# EAGLE design LPC2LCD (EAGLE 9.3.1)
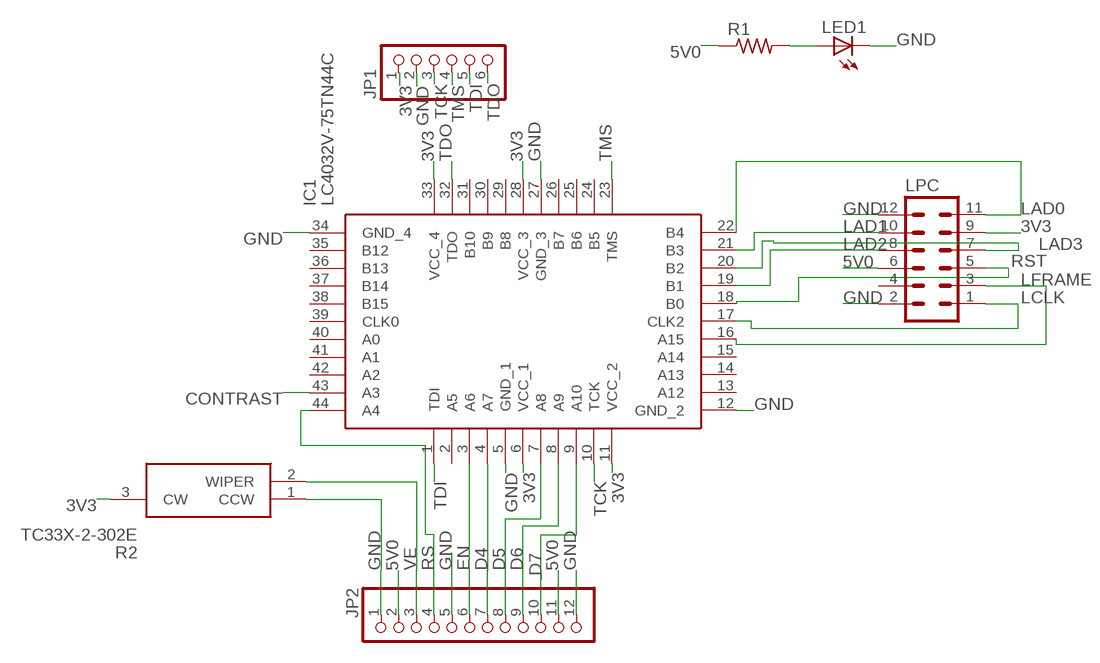
[diagram p0: schematic, sheet 1]

## Parts
IC1  LC4032V-75TN44C  [QFP80P1200X1200X120-44N]
JP1  PINHD-1X6B  [1X06-BIG]
JP2  PINHD-1X12  [1X12]
LED1  LEDCHIPLED_0805  [CHIPLED_0805]
LPC  MA06-2  [MA06-2]
R1  R-US_R0805  [R0805]
R2  TC33X-2-302E  [TC33X-2]

## Nets
3V3: IC1.6(VCC_1) IC1.11(VCC_2) IC1.28(VCC_3) IC1.33(VCC_4) JP1.1 LPC.9 R2.3(CW)
5V0: JP2.2 JP2.11 LPC.6 R1.1
CONTRAST: IC1.43(A3)
D4: IC1.4(A7) JP2.7
D5: IC1.7(A8) JP2.8
D6: IC1.8(A9) JP2.9
D7: IC1.9(A10) JP2.10
EN: IC1.3(A6) JP2.6
GND: IC1.5(GND_1) IC1.12(GND_2) IC1.27(GND_3) IC1.34(GND_4) JP1.2 JP2.1 JP2.5 JP2.12 LED1.C LPC.2 LPC.12 R2.1(CCW)
LAD0: IC1.22(B4) LPC.11
LAD1: IC1.21(B3) LPC.10
LAD2: IC1.19(B1) LPC.8
LAD3: IC1.20(B2) LPC.7
LCLK: IC1.17(CLK2) LPC.1
LFRAME: IC1.16(A15) LPC.3
N$1: LED1.A R1.2
RS: IC1.44(A4) JP2.4
RST: IC1.18(B0) LPC.5
TCK: IC1.10(TCK) JP1.3
TDI: IC1.1(TDI) JP1.5
TDO: IC1.32(TDO) JP1.6
TMS: IC1.23(TMS) JP1.4
VE: JP2.3 R2.2(WIPER)
Unconnected: IC1.2(A5) IC1.13(A12) IC1.14(A13) IC1.15(A14) IC1.24(B5) IC1.25(B6) IC1.26(B7) IC1.29(B8) IC1.30(B9) IC1.31(B10) IC1.35(B12) IC1.36(B13) IC1.37(B14) IC1.38(B15) IC1.39(CLK0) IC1.40(A0) IC1.41(A1) IC1.42(A2) LPC.4

## Library data of the parts
IC1 = SamacSys_Parts:LC4032V-75TN44C: LC4032V-75TN44C, CPLD ispMACH 4000V EEPROM 32 Cells, 30 I/O, 36 Labs, 7.5ns, ISP, 3 3.6 V 44-Pin TQFP Source: Datasheet <https://componentsearchengine.com/Datasheets/1/LC4032V-75TN44C.pdf>; DESCRIPTION: LC4032V-75TN44C, CPLD ispMACH 4000V EEPROM 32 Cells, 30 I/O, 36 Labs, 7.5ns, ISP, 3 3.6 V 44-Pin TQFP; HEIGHT: 1.2mm; MANUFACTURER_NAME: Lattice Semiconductor; MANUFACTURER_PART_NUMBER: LC4032V-75TN44C; MOUSER_PART_NUMBER: 842-LC4032V75TN44C; MOUSER_PRICE-STOCK: https://www.mouser.com/Search/Refine.aspx?Keyword=842-LC4032V75TN44C
JP1 = adafruit:PINHD-1X6: PIN HEADER
JP2 = adafruit:PINHD-1X12: PIN HEADER
LED1 = adapter_ms9282:LED: LED OSRAM: - CHIPLED LG R971, LG N971, LY N971, LG Q971, LY Q971, LO R971, LY R971 LH N974, LH R974 LS Q976, LO Q976, LY Q976 LO Q996 - Hyper CHIPLED LW Q18S LB Q993, LB Q99A, LB R99A - SideLED LS A670, LO A670, LY A670, LG A670, LP A670 LB A673, LV A673, LT A673, LW A673 LH A674 LY A675 LS A676, LA A676, LO A676, LY A676, LW A676 LS A679, LY A679, LG A679 - Hyper Micro SIDELED® LS Y876, LA Y876, LO Y876, LY Y876 LT Y87S - SmartLED LW L88C, LW L88S LB L89C, LB L89S, LG L890 LS L89K, LO L89K, LY L89K LS L896, LA L896, LO L896, LY L896 - TOPLED LS T670, LO T670, LY T670, LG T670, LP T670 LSG T670, LSP T670, LSY T670, LOP T670, LYG T670 LG T671, LOG T671, LSG T671 LB T673, LV T673, LT T673, LW T673 LH T674 LS T676, LA T676, LO T676, LY T676, LB T676, LH T676, LSB T676, LW T676 LB T67C, LV T67C, LT T67C, LS T67K, LO T67K, LY T67K, LW E67C LS E67B, LA E67B, LO E67B, LY E67B, LB E67C, LV E67C, LT E67C LW T67C LS T679, LY T679, LG T679 LS T770, LO T770, LY T770, LG T770, LP T770 LB T773, LV T773, LT T773, LW T773 LH T774 LS E675, LA E675, LY E675, LS T675 LS T776, LA T776, LO T776, LY T776, LB T776 LHGB T686 LT T68C, LB T68C - Hyper Mini TOPLED® LB M676 - Mini TOPLED Santana® LG M470 LS M47K, LO M47K, LY M47K Source: http://www.osram.convergy.de/
LPC = con-lstb:MA06-2: PIN HEADER; OC_FARNELL: unknown; OC_NEWARK: unknown
R1 = adapter_ms9282:R-US_: RESISTOR, American symbol
R2 = OXC_Library:TC33X-2-302E: Trimmer Resistors - SMD 3MM 3KOHMS 25% 0.1WATT OPEN FRM Source: Datasheet <https://componentsearchengine.com/Datasheets/1/TC33X-2-302E.pdf>; DESCRIPTION: Trimmer Resistors - SMD 3MM 3KOHMS 25% 0.1WATT OPEN FRM; HEIGHT: mm; MANUFACTURER_NAME: Bourns; MANUFACTURER_PART_NUMBER: TC33X-2-302E; MOUSER_PART_NUMBER: 652-TC33X-2-302E; MOUSER_PRICE-STOCK: https://www.mouser.com/Search/Refine.aspx?Keyword=652-TC33X-2-302E

## Board
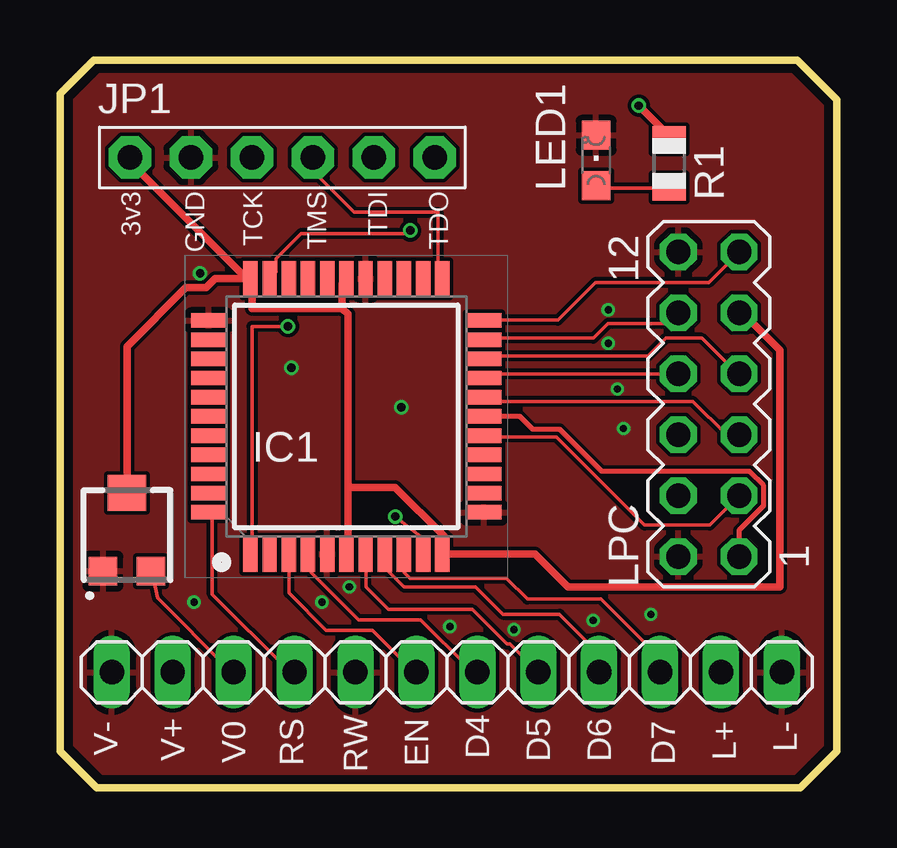
[diagram p1: board, top side]
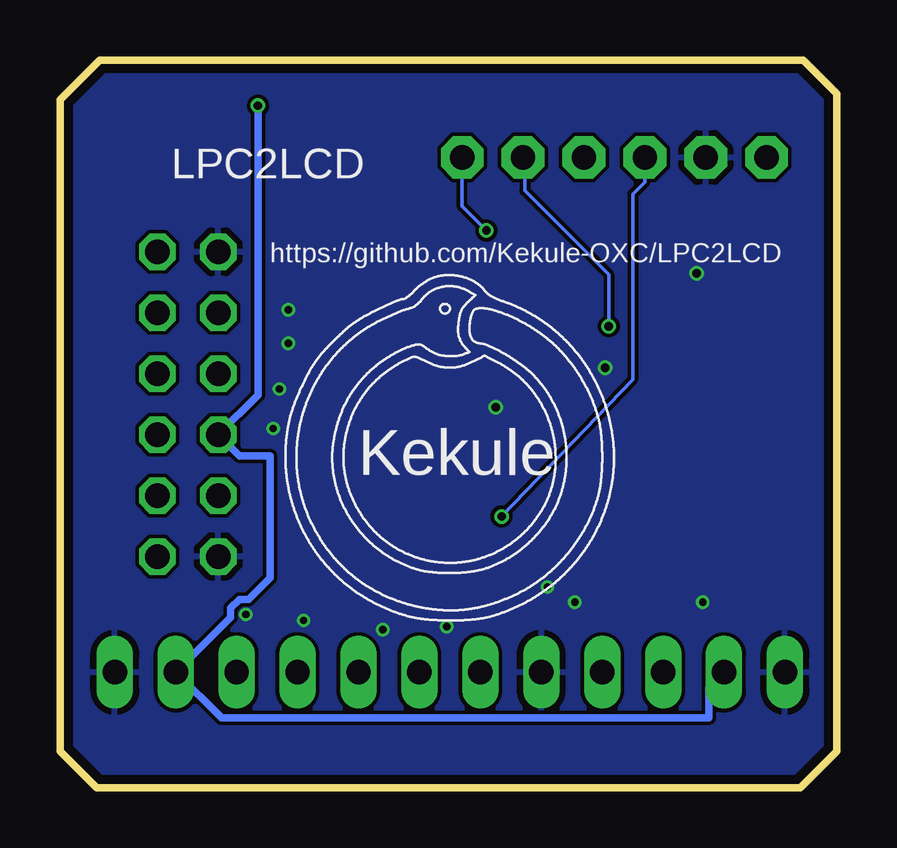
[diagram p2: board, bottom side, seen from below]

Size 32.38 x 30.35 mm. Coordinates in mm from the lower left corner, seen from the top.
Outline: 0,28.96 0,1.52 1.52,0 30.86,0 32.38,1.52 32.38,28.7 30.73,30.35 1.4,30.35 0,28.96
Copper layers (1*16): Top 0.035559375mm / dielectric 1.6mm / Bottom 0.035559375mm
Design rules "oshpark-2layer": minimum track width 6mil, minimum drill 10mil, track to track 6mil, track to pad 6mil, pad to pad 6mil, via to via 6mil, smd to smd 6mil, copper to edge 15mil, drill to drill 6mil, minimum pad ring 5mil, minimum via ring 5mil, stop-mask expansion 2.5mil, vias tented up to drill 0mil, thermal gap 10mil

### Footprints (pad centres in the part's own frame; a part is rotated, then mirrored left to right if it is on the bottom)
QFP80P1200X1200X120-44N = smd 1.475 x 0.6: 1 -5.738,4; 2 -5.738,3.2; 3 -5.738,2.4; 4 -5.738,1.6; 5 -5.738,0.8; 6 -5.738,0; 7 -5.738,-0.8; 8 -5.738,-1.6; 9 -5.738,-2.4; 10 -5.738,-3.2; 11 -5.738,-4; 23 5.738,-4; 24 5.738,-3.2; 25 5.738,-2.4; 26 5.738,-1.6; 27 5.738,-0.8; 28 5.738,0; 29 5.738,0.8; 30 5.738,1.6; 31 5.738,2.4; 32 5.738,3.2; 33 5.738,4 | smd 0.6 x 1.475: 12 -4,-5.738; 13 -3.2,-5.738; 14 -2.4,-5.738; 15 -1.6,-5.738; 16 -0.8,-5.738; 17 0,-5.738; 18 0.8,-5.738; 19 1.6,-5.738; 20 2.4,-5.738; 21 3.2,-5.738; 22 4,-5.738; 34 4,5.738; 35 3.2,5.738; 36 2.4,5.738; 37 1.6,5.738; 38 0.8,5.738; 39 0,5.738; 40 -0.8,5.738; 41 -1.6,5.738; 42 -2.4,5.738; 43 -3.2,5.738; 44 -4,5.738
1X06-BIG = drill 1.016 pad 1.778 octagon: 1 -6.35,0; 2 -3.81,0; 3 -1.27,0; 4 1.27,0; 5 3.81,0; 6 6.35,0
1X12 = drill 1.016 long: 1 -13.97,0; 2 -11.43,0; 3 -8.89,0; 4 -6.35,0; 5 -3.81,0; 6 -1.27,0; 7 1.27,0; 8 3.81,0; 9 6.35,0; 10 8.89,0; 11 11.43,0; 12 13.97,0
CHIPLED_0805 = smd 1.2 x 1.2: A 0,-1.05; C 0,1.05
MA06-2 = drill 1.016 octagon: 1 -6.35,-1.27; 2 -6.35,1.27; 3 -3.81,-1.27; 4 -3.81,1.27; 5 -1.27,-1.27; 6 -1.27,1.27; 7 1.27,-1.27; 8 1.27,1.27; 9 3.81,-1.27; 10 3.81,1.27; 11 6.35,-1.27; 12 6.35,1.27
R0805 = smd 1.1 x 1.4: 1 -1,0; 2 1,0
TC33X-2 = smd 1.2 x 1.2: 1 -1,-1.625; 2 1,-1.625 | smd 1.6 x 1.5: 3 0,1.625

### Placement (x,y rotation side)
IC1  11.94,15.49 90 top
JP1  9.27,26.29 0 top
JP2  16.13,4.83 0 top
LED1  22.35,26.16 0 top
LPC  27.05,16 90 top
R1  25.4,26.04 270 top
R2  2.79,10.67 0 top
U$1  [KEKULE-0002]  22.99,6.99 0 bottom

### Tracks (layer width: path | path; a pad name or v marks a point on that pad's centre or on a via)
3V3
  Top 0.152: 16,10.5 16,10 IC1.11 16,9.75 | 12,10 IC1.6 | 11.75,20 11.63,20 | 8,21 IC1.33 7.75,21.25 | 11.75,21 IC1.28 | 28.5,19.75 LPC.9 | 2.75,26.25 JP1.1
  Top 0.305: 12,10 12,10.75 12,11.64 12,12.53 | 12,12.53 13.98,12.53 16,10.5 | 8,21 8,20 11.63,20 11.76,20 12,19.75 12,12.53 | 11.75,21 11.75,20 | 2.75,26.25 7.75,21.25 | 28.5,19.75 30,18.25 30,8.38 21.18,8.38 19.81,9.75 16,9.75 | IC1.33 6.47,21.23 6.09,20.86 5.23,20.86 2.79,18.41 R2.3
5V0  (via drill 0.35)
  Top 0.305: v24.13,28.45 25.4,27.18 R1.1
  Bottom 0.305: JP2.2 5.33,4.19 5.33,2.92 25.65,2.92 JP2.11 25.27,7.11 25.27,7.5 24.9,7.87 24.51,7.87 23.62,8.76 23.62,13.84 24.89,13.84 LPC.6 24.13,16.38 v24.13,28.45
CONTRAST
  Top 0.152: 6.2,12.19 IC1.43
D4
  Top 0.152: IC1.4 10.46,9.75 10.46,8.99 12.45,7.01 15.04,7.01 17.03,5.02 17,5 17.25,5 JP2.7
D5
  Top 0.152: IC1.7 12.75,9.75 12.75,8.38 13.69,7.44 17.19,7.44 18.63,6 18.75,6 19.75,5 JP2.8
D6
  Top 0.152: IC1.8 13.55,9.74 13.55,9.18 14.35,8.38 17.32,8.38 18.46,7.24 20.83,7.24 22.29,5.78 22.25,5.75 22.25,5 JP2.9
D7
  Top 0.152: IC1.9 14.34,8.99 14.59,8.74 18.62,8.74 19.48,7.87 22.55,7.87 24.72,5.71 24.75,5.75 24.75,5.25 25,5 JP2.10
EN
  Top 0.152: 9.55,9.14 9.55,8.13 11.1,6.58 13.03,6.58 14.56,5.05 14.5,5 14.75,5 JP2.6 | 9.55,9.14 9.55,9.75 IC1.3 9.55,9.14
GND  (via drill 0.3, 0.35)
  Top 0.152: IC1.5 11.25,9.75 11.16,9.78
  other vias: 9.65,17.53 14.22,15.88 5.84,21.46 10.92,7.75 12.06,8.38 18.92,6.6 22.23,6.99 24.64,7.24 16.26,6.73 5.59,7.75 23.5,14.99 22.86,19.94 22.86,18.54 23.24,16.64
  pour Top: -0.76,31.11 33.53,31.11 33.53,-1.02 -0.76,-1.02
  pour Bottom: -0.89,31.5 33.15,31.5 33.15,-0.64 -0.89,-0.64 -0.89,31.37
LAD0
  Top 0.152: LPC.11 27.05,21.08 22.33,21.08 20.75,19.5 17.75,19.5 IC1.22
LAD1
  Top 0.152: IC1.21 17.73,18.75 22.23,18.75 22.85,19.37 25.59,19.37 LPC.10
LAD2
  Top 0.152: IC1.19 17.75,17.25 25.75,17.25 LPC.8
LAD3
  Top 0.152: IC1.20 17.75,18 24.5,18 25.25,18.75 26.75,18.75 28,17.5 28.25,17.5 LPC.7
LCLK
  Top 0.2: LPC.1 28.32,10.76 29.34,11.77 29.34,12.61 28.74,13.21 22.59,13.21 20.84,14.96 19.71,14.96 19.18,15.49 IC1.17
LFRAME
  Top 0.152: LPC.3 27.09,10.96 24.37,10.96 20.7,14.63 17.7,14.63 IC1.16
N$1
  Top 0.152: LED1.A 22.5,25 25.25,25 R1.2
RS
  Top 0.152: IC1.44 6.35,11.43 6.35,8.08 9.47,4.96 9.5,5 9.75,5 JP2.4
RST
  Top 0.152: IC1.18 17.98,16.12 26.38,16.12 27.75,14.75 28.25,14.75 28.3,14.78 LPC.5
TCK  (via drill 0.35)
  Top 0.152: IC1.10 15.14,10.4 v13.97,11.32
  Bottom 0.152: v13.97,11.32 8.5,17.04 8.5,24.75 8,25.25 8,26.25 JP1.3
TDI  (via drill 0.35)
  Top 0.152: v9.5,19.25 8,19.25 8,10 IC1.1
  Bottom 0.152: v9.5,19.25 9.5,21.41 13,24.9 13,26 13,26.25 JP1.5
TDO  (via drill 0.35)
  Top 0.152: IC1.32 9.01,21.5 9.01,22.06 10.06,23.11 14.48,23.11 v14.61,23.24
  Bottom 0.152: v14.61,23.24 15.62,24.26 JP1.6
TMS
  Top 0.152: IC1.23 15.75,21.25 15.75,24 12.25,24 10.75,25.5 10.75,26.25 JP1.4
VE
  Top 0.152: R2.2 3.84,9 4.06,7.92 7,4.99 7,5 JP2.3

### Text on the board
tNames: 3v3 | GND | TCK | TMS | TDI | TDO | V- | V+ | V0 | RS | RW | EN | D4 | D5 | D6 | D7 | L+ | L-
bNames: LPC2LCD | https://github.com/Kekule-OXC/LPC2LCD